# Altium schematic sheet ESP8266_GSM_switch.SchDoc
size A; SheetNumber: 1; SheetTotal: 1
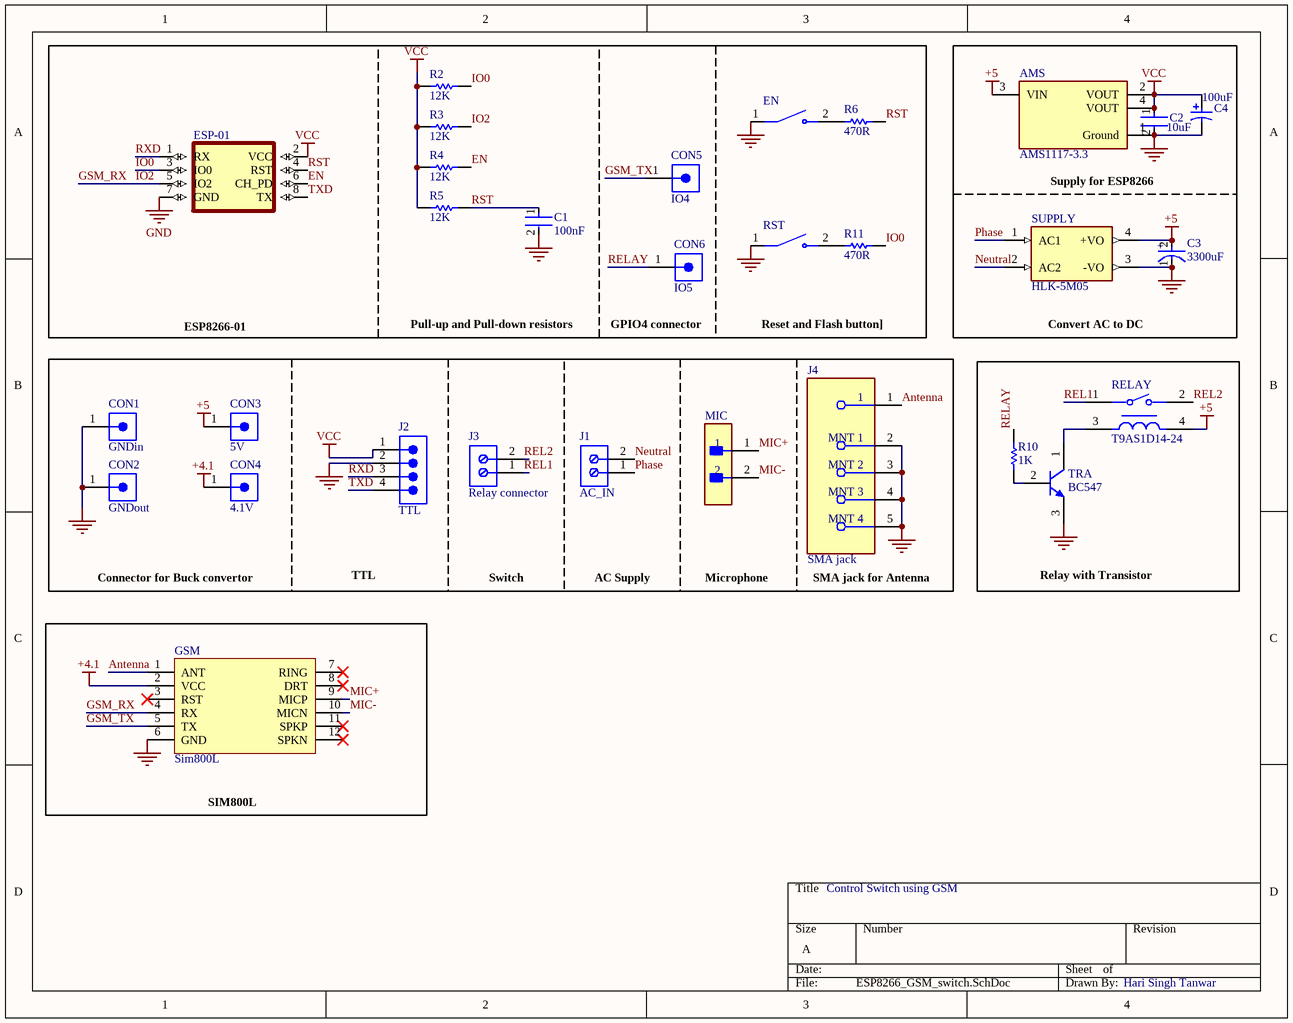
[diagram p0: ESP8266_GSM_switch.SchDoc]

## Parts
AMS  AMS1117-3.3  [FP-AMS1117-IPC_C]
C1  100nF  [FP-0805-L_2_01_0_2-W_1_25-IPC_B]
C2  10uF  [FP-C0805C-DG-MFG]
C3  3300uF  [FP-RAD-TH-D_12_5_0_5-L_40-MFG]
C4  100uF  [PNSC-FK-V-D8_V]
CON1  GNDin  [61300111121]
CON2  GNDout  [61300111121]
CON3  5V  [61300111121]
CON4  4.1V  [61300111121]
CON5  IO4  [61300111121]
CON6  IO5  [61300111121]
EN  TS09-63-25-WT-160-SMT-TR  [SW_TS09-63-25-WT-160-SMT-TR]  (value not drawn)
ESP-01  ESP-01  [ESP-01]  (value not drawn)
GSM  Sim800L  [Sim800L]
J1  AC_IN  [691137710002]
J2  TTL  [61300411121]
J3  Relay connector  [691137710002]
J4  SMA jack  [FP-221790-1-MFG]
MIC  Microphone connector  [FP-B2B-XH-A_LF_SN-MFG]  (value not drawn)
R2  12K  [RESC2013X70X40ML20T20]
R3  12K  [RESC2013X70X40ML20T20]
R4  12K  [RESC2013X70X40ML20T20]
R5  12K  [RESC2013X70X40ML20T20]
R6  470R  [RESC2013X70X40ML20T20]
R10  1K  [RESC2013X60X40ML20T25]
R11  470R  [RESC2013X70X40ML20T20]
RELAY  T9AS1D14-24  [FP-T9AS1D14-24-MFG]
RST  TS09-63-25-WT-160-SMT-TR  [SW_TS09-63-25-WT-160-SMT-TR]  (value not drawn)
SUPPLY  HLK-5M05  [CONV_HLK-5M05]
TRA  BC547  [ONSC-TO-92-3-29-11_AM_BL]

## Blocks framed on the sheet
Relay with Transistor: R10 RELAY TRA
SIM800L: GSM

## Nets
+4.1: CON4.1 GSM.2(VCC)
+5: AMS.3(VIN) C3.2(A) CON3.1 RELAY.4 SUPPLY.4(+VO)
GND: AMS.1(Ground) C1.2 C2.2 C3.1(C) C4.2 CON1.1 CON2.1 EN.1 ESP-01.7(GND) GSM.6(GND) J2.2 J4.2(MNT_1) J4.3(MNT_2) J4.4(MNT_3) J4.5(MNT_4) RST.1 SUPPLY.3(-VO) TRA.3(E)
VCC: AMS.2(VOUT) AMS.4(VOUT) C2.1 C4.1 ESP-01.2(VCC) J2.1 R2.1 R3.1 R4.1 R5.1
Antenna: GSM.1(ANT) J4.1
EN: ESP-01.6(CH_PD) R4.2
GSM_RX: ESP-01.5(IO2) GSM.4(RX) R3.2  [also labelled IO2]
GSM_TX: CON5.1 GSM.5(TX)
IO0: ESP-01.3(IO0) R2.2 R11.2
MIC+: GSM.9(MICP) MIC.1
MIC-: GSM.10(MICN) MIC.2
Neutral: J1.2 SUPPLY.2(AC2)
Phase: J1.1 SUPPLY.1(AC1)
REL1: J3.1 RELAY.1
REL2: J3.2 RELAY.2
RELAY: CON6.1 R10.2
RST: C1.1 ESP-01.4(RST) R5.2 R6.2
RXD: ESP-01.1(RX) J2.3
TXD: ESP-01.8(TX) J2.4
NetEN_2: EN.2 R6.1
NetR10_1: R10.1 TRA.2(B)
NetR11_1: R11.1 RST.2
NetRELAY_3: RELAY.3 TRA.1(C)

Not connected (* = marked no-connect by the designer): GSM 3(RST)* 7(RING)* 8(DRT)* 11(SPKP)* 12(SPKN)*

## Notes on the sheet
- Supply for ESP8266
- ESP8266-01
- Pull-up and Pull-down resistors
- (near CON6) GPIO4 connector
- Reset and Flash button]
- Convert AC to DC
- Connector for Buck convertor
- TTL
- Switch
- AC Supply
- Microphone
- (near J4) SMA jack for Antenna
- Control Switch using GSM
- Hari Singh Tanwar
- (in symbol CMP-05427-001733-1) +

## Library data of the parts
AMS = CMP-209535-000001-1: LDO Voltage Regulators 1A, 3.3V; Manufacturer: Advanced Monolithic Systems; Dropout Voltage: 1.1V; Output Type: Fixed; Nominal Supply Current: 5mA; Max Power Dissipation: 1.2W; Max Supply Voltage: 15V; Number Of Outputs: 1; Standoff Height: 0.64mm; Max Junction Temp: +125°C; Height: 1.8mm; Package: AMS1117; Device Class L2: Power Management ICs; ComponentLink2Description: Datasheet; ComponentLink2URL: http://www.advanced-monolithic.com/pdf/ds1117.pdf; Category: IC; RoHS: TRUE; Automotive: No; Device Class L1: Integrated Circuits (ICs); Output Current: 1A; Device Class L3: Voltage Regulators - Linear; Temperature: -40°C to +125°C; Output Voltage: 3.3V; Manufacturer Part Number: AMS1117-3.3; Temperature Range Low: -40°C; Octopart: https://octopart.com/ams1117-3.3-advanced+monolithic+systems-25899300; Lead Free: Yes; Ipc Land Pattern Name: SOT229P700X180-4; Temperature Range High: +125°C
C1 = CMP-2007-04174-2: General Purpose Ceramic Capacitor, 0805, 100nF, 10%, X7R, 15%, 100V; Packaging: Tape and Reel; Min Operating Temperature: -55°C; Dielectric Material: Ceramic; Height: 1.4mm; Voltage Rating: 100V; Termination: SMD/SMT; Case Code (Imperial): 0805; Case Code (Metric): 2012; Case/Package: 0805; Construction: Flat; Radiation Hardening: No; Series: -; Dielectric: X7R; Package Quantity: 2000; Mount: Surface Mount; Capacitance: 100nF; Contact Plating: Tin; Voltage: 100V; Lead Free: Lead Free; Depth: 1.25mm; RoHS Compliant: Yes; Number of Pins: 2; Max Operating Temperature: 125°C; Length: 2.01mm; Voltage Rating (DC): 100V; Thickness: 0.055inch; REACH SVHC: No SVHC; Width: 0.049inch; Tolerance: 10%
C2 = CMP-2007-03243-2: CAP CER 10UF 10V X5R 0805; Manufacturer Part Number: C0805C106K8PACTU; Manufacturer: Kemet; 3DS Part Number: 220-00001; Tolerance: 10%; Temperature Coefficient: 15%; Material: Ceramic; Device Class L2: Capacitors; Device Class L1: Passive Components; ComponentLink2URL: https://content.kemet.com/datasheets/KEM_C1006_X5R_SMD.pdf; Height: 1.4mm; Lead Free: Yes; Digikey Description: CAP CER 10UF 10V X5R 0805; Octopart: https://octopart.com/c0805c106k8pactu-kemet-98697; Capacitance: 10uF; Value: 10uF; Temperature Range Low: -55°C; Temperature: -55°C to +85°C; Automotive: No; Mouser Description: CAP CER 10UF 10V X5R 0805; Ipc Land Pattern Name: CAPC200125X125; Temperature Range High: +85°C; Voltage: 10V; RoHS: TRUE; Device Class L3: Ceramic Capacitors; ComponentLink2Description: Datasheet; Voltage Rating: 10V; Package: C0805C-DG; Temperature Characteristic: X5R; Category: Cap
C3 = CMP-05427-001733-1: Aluminum Electrolytic Capacitors (Radial Lead Type) AEC-Q200 Qualified 3300uF ±20% 25V; Life (Hours): 5000Hour; Dielectric Material: Aluminium; Impedance: 14mR; Capacitance: 3.3mF; Ripple Current: 3.01A; Lead Diameter: 0.8mm; Contact Plating: Tin; Min Operating Temperature: -55°C; Termination: Radial; REACH SVHC: No SVHC; RoHS Compliant: Yes; Series: FK; Number of Pins: 2; Package Quantity: 100; Case/Package: Radial; Lead Pitch: 5mm; Voltage Rating (DC): 25V; Radiation Hardening: No; Tolerance: 20%; Construction: RADIAL; Mount: Through Hole; Diameter: 12.5mm; Packaging: Bulk; Max Operating Temperature: 105°C; Voltage Rating: 25V; Voltage: 25V; Height: 40mm
C4 = CMP-2000-06206-1: Aluminum Electrolytic Capacitor, 100 uF, +/- 20%, 25 V, 2-Pin SMD (Size Code D8), -55 to 105 degC, RoHS, Tape and Reel; Manufacturer: Panasonic; Type: Can; Lifetime@Temperature: 2000Hrs@105°C; Capacitance: 100µF; Rated Voltage: 25V; Ripple Current: 280mA; Impedance: 0.34O; Case Size/Dimension: Ø6.3x7.7mm; Operating Temp-Max: 105°C; Series: FK; Package URL: http://industrial.panasonic.com/cdbs/www-data/pdf/RDE0000/DME0000COL48.pdf; Mounting Technology: SurfaceMount; Package Description: 2-Pin Electrolytic Aluminum Capacitor, Body 6.6 x 6.6 mm; Datasheet Version: 03/2016; Datasheet URL: http://industrial.panasonic.com/cdbs/www-data/pdf/RDE0000/ABA0000C1181.pdf; Manufacturer URL: http://www.panasonic.com/; Package Reference: FK-V-D8; Operating Temp Range: -55to+105°C
CON1-CON6 = CMP-1502-01058-2: NexarPartId: 32855518; Operating Supply Voltage: 250V; Connector Type: Male Pin; Contact Resistance: 20mΩ; Number of Contacts: 1; Gender: Male; Current Rating: 3A; Contact Mating Length: 5.9944mm; Number of Pins: 1; Lead Pitch: 2.54mm; Contact Plating: Gold; RoHS: Compliant; Termination: Solder; Mount: Through Hole; Number of Rows: 1; Orientation: Vertical; Contact Material: Copper; Packaging: Bulk; REACH SVHC: Unknown; Number of Positions: 1; Color: Black
ESP-01 = ESP-01: ESP8266 ESP-01 Transceiver; 802.11 b/g/n (Wi-Fi, WiFi, WLAN) Evaluation Board; MF: AI-Thinker; Check_prices: https://www.snapeda.com/parts/ESP-01/AI-Thinker/view-part/5164489/?ref=eda; Value: *; Availability: In Stock; Price: None; SnapEDA_Link: https://www.snapeda.com/parts/ESP-01/AI-Thinker/view-part/5164489/?ref=snap; Package: Package; MP: ESP-01; Purchase-URL: https://pricing.snapeda.com/search/part/ESP-01/?ref=eda
J1 J3 = CMP-1502-03324-2: NexarPartId: 78871135; Voltage Rating: 300V; Number of Contacts: 2; Current Rating: 16A; Lead Pitch: 5mm; Height: 11.6mm; Packaging: Box; RoHS: Non-Compliant; Contact Material: Nickel, Tin; Max Operating Temperature: 120°C; Number of Pins: 2; Min Operating Temperature: -30°C; Number of Rows: 1
J2 = CMP-1502-01064-2: NexarPartId: 32855522; Pitch: 2.54mm; Number of Contacts: 4; Contact Resistance: 20mΩ; Gender: Male; Current Rating: 3A; Connector Type: Male Pin; Voltage Rating: 250V; Lead Free: Lead Free; Contact Plating: Gold; Max Operating Temperature: 105°C; Packaging: Bulk; Height: 8.89mm; Orientation: Vertical; Contact Mating Length: 5.9944mm; Contact Material: Copper; Lead Pitch: 2.54mm; Min Operating Temperature: -40°C; Termination: Solder; Color: Black; Number of Rows: 1; REACH SVHC: Unknown; RoHS: Compliant; Mount: Through Hole; Number of Positions: 4; Number of Pins: 4; Operating Supply Voltage: 250V
J4 = CMP-05166-000001-1: CONN SMA JACK R/A 50 OHM PCB; Manufacturer Part Number: 221790-1; Manufacturer: TE Connectivity / AMP; Is Female: yes; Impedance: 50Ω; Number Of Contacts: 1; Shielding: true; Voltage Rating: 335V; Frequency: 4GHz; Dielectric Material: Fluoropolymer; Conn Orientation: Right Angle; Octopart: https://octopart.com/2217901-te+connectivity+%2F+amp-3339836; Contact Material: Gold; Temperature: -65°C to +165°C; RoHS: TRUE; Device Class L1: Connectors; Temperature Range Low: -65°C; Mouser Description: RF Connectors / Coaxial Connectors PCB RIGHT ANGLE JACK; Lead Free: Yes; Device Class L3: unset; Temperature Range High: +165°C; ComponentLink2URL: https://www.te.com/commerce/DocumentDelivery/DDEController?Action=showdoc&DocId=Customer+Drawing%7F221790%7FB1%7Fpdf%7FEnglish%7FENG_CD_221790_B1.pdf%7F221790-1; Package: 0; ComponentLink2Description: Datasheet; Digikey Description: CONN SMA JACK R/A 50 OHM PCB; Device Class L2: RF / Coaxial Connectors; Category: Conn; Height: 0.38inch; Automotive: No
MIC = CMP-2000-05888-3: CONN HEADER VERT 2POS 2.5MM; Current Rating: 3A; Voltage Rating: 250V; Number of Contacts: 2; Contact Resistance: 20mR; Wire/Cable Gauge: 22AWG; Insulation Resistance: 1GR; Connector Type: Male Pin; Packaging: Bulk; Contact Material: Brass; Lead Free: Lead Free; Orientation: Straight; Contact Plating: Tin; Max Current Rating: 3A; Termination: Solder; Fastening Type: Detent; Depth: 5.75mm; Housing Material: Polyamide; REACH SVHC: No SVHC; Series: XH; Voltage Rating (AC): 250V; Number of Positions: 2; Color: Natural; Contact Type: Male Pin; Max Voltage Rating (DC): 250V; Pitch: 2.5mm; Lead Pitch: 2.5mm; Mount: Through Hole; Max Operating Temperature: 85°C; Length: 7.4mm; Max Voltage Rating (AC): 250V; Min Operating Temperature: -25°C; Number of Rows: 1; Housing Color: White
R2-R5 = CMP-2001-00513-1: Manufacturer: Panasonic; Part Number: ERJ6ENF1202V
R6 R11 = CMP-2001-00549-5: Chip Resistor, 470 Ohm, +/- 1%, 0.125 W, -55 to 155 degC, 0805 (2012 Metric), RoHS, Tape and Reel; Manufacturer: Panasonic; Voltage Rating: 150 V; ComponentLink1URL: http://www.panasonic.com/; ComponentLink2Description: Datasheet; RoHSCompliant: true; PackageDescription: 2-Pin Surface Mount Device, Body 2 x 1.25 mm; PackageReference: 0805; REACH SVHC: Yes; Max Operating Temperature: 155 degC; Mount: Surface Mount; Min Operating Temperature: -55 degC; DatasheetVersion: 04/2015; Mounting Technology: Surface Mount; Height: 0.6 mm; Package Quantity: 1; ComponentLink2URL: http://industrial.panasonic.com/cdbs/www-data/pdf/RDA0000/AOA0000C86.pdf; Length: 2 mm; ComponentLink1Description: Manufacturer URL; Pins: 2; Packaging: Cut Tape
R10 = CMP-2001-00590-1: Part Number: ERA6AEB123V; Manufacturer: Panasonic
RELAY = CMP-03395-000263-1: RELAY GEN PURPOSE SPST 30A 24V; Insulation Resistance: 1GR; Coil Type: Non-Latching; Coil Current: 42mA; Contact Voltage Rating (AC): 277V; Coil Resistance: 576R; Coil Power: 1W; Contact Material: Tin; Throw Configuration: SPST; Height: 20.4mm; Width: 27.4mm; ELV: Compliant; Termination: PCB; REACH SVHC: No SVHC; Length: 32.5mm; Contact Current Rating: 30A; Weight: 0.918oz; Coil Voltage (DC): 24V; Packaging: Tray; RoHS Compliant: Yes
SUPPLY = HLK-5M05: AC DC 220V to 5V 5W 5Watt Isolated Switching Step-Down Power Supply Module Converter; MF: Hi-link; Check_prices: https://www.snapeda.com/parts/HLK-5M05/Hi-link/view-part/?ref=eda; SnapEDA_Link: https://www.snapeda.com/parts/HLK-5M05/Hi-link/view-part/?ref=snap; Price: None; Availability: Not in stock; Package: Package; MP: HLK-5M05; Value: *
TRA = CMP-1048-01605-1: Amplifier Transistor, NPN Silicon, 3-Pin TO-92, Pb-Free, Tape and Reel; Manufacturer: On Semiconductor; PartNumber: BC547BRL1G; IC Continuous (A): 0.1; fT Min (MHz): 150; ComponentLink2URL: http://www.onsemi.com/pub_link/Collateral/BC546-D.PDF; ComponentLink1URL: http://www.onsemi.com/; ComponentLink2Description: Datasheet; RoHS: TRUE; ComponentLink3Description: Package Specification; ComponentLink1Description: Manufacturer URL; ComponentLink3URL: http://www.onsemi.com/pub_link/Collateral/MAC97-D.PDF; PackageDescription: 3-Pin Transistor Outline, Body 4.825 x 3.685 mm, Pitch 1.27 mm; Packing: Tape and Reel; PackageVersion: Rev. AM; Polarity: NPN; DatasheetVersion: Rev. 7; Mounting Technology: Through Hole; PackageReference: TO-92-3-29-11_AM_BL
EN RST = TS09-63-25-WT-160-SMT-TR: Price: None; Availability: Unavailable; Package: None; Value: *; MP: TS09-63-25-WT-160-SMT-TR